# EAGLE design hbridge_v2 (EAGLE 6.4)
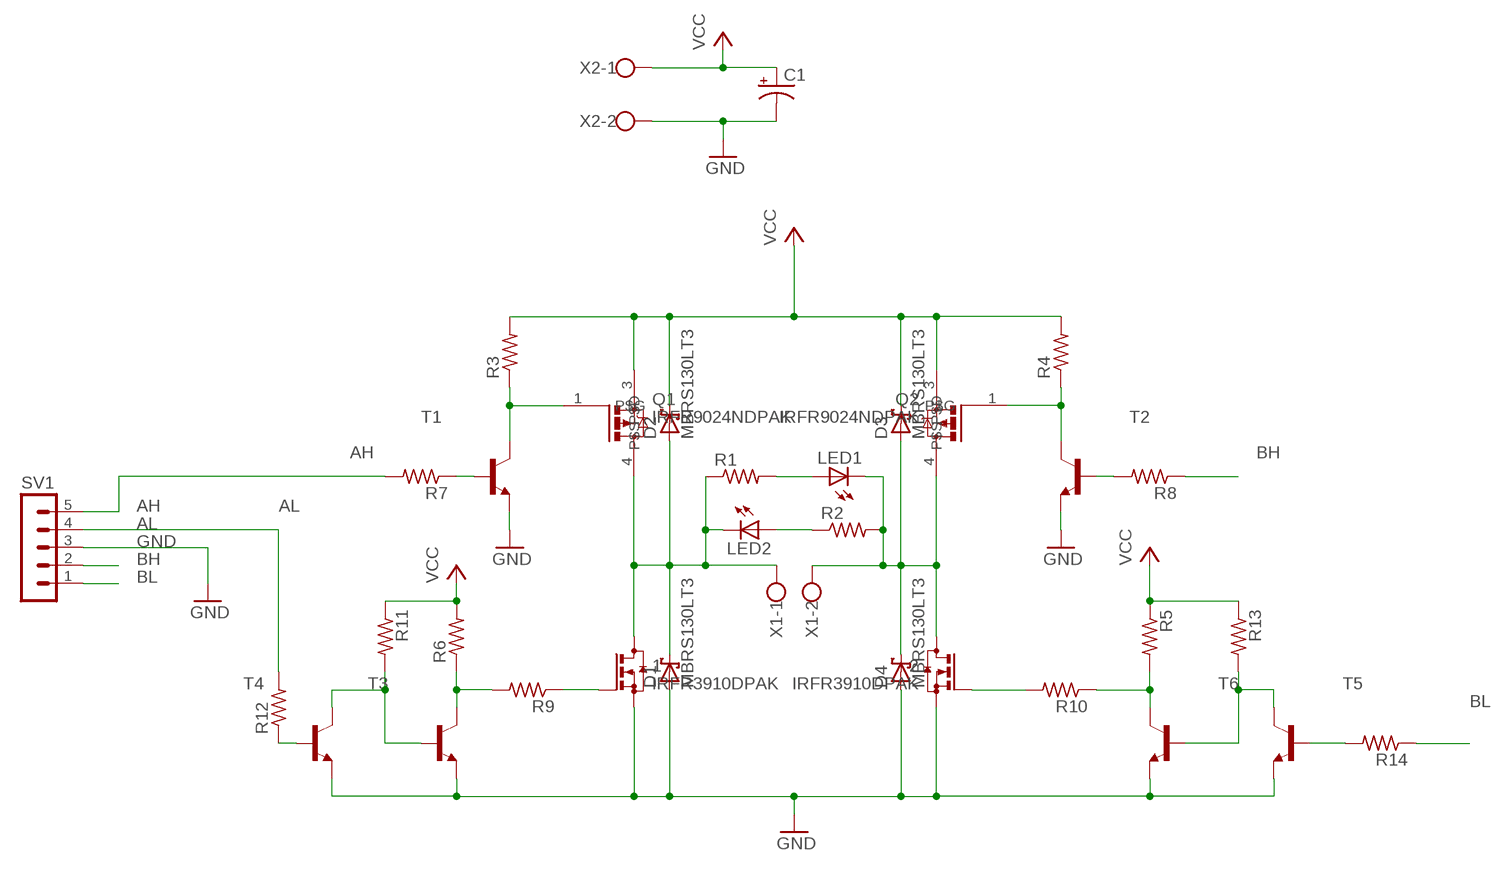
[diagram p0: schematic, sheet 1]

## Parts
1  IRFR3910DPAK  [D-PAK_TO252AA]
2  IRFR3910DPAK  [D-PAK_TO252AA]
C1  CPOL-USE5-10.5  [E5-10,5]
D1  MBRS130LT3  [SMB]
D2  MBRS130LT3  [SMB]
D3  MBRS130LT3  [SMB]
D4  MBRS130LT3  [SMB]
LED1  LEDCHIP-LED0805  [CHIP-LED0805]
LED2  LEDCHIP-LED0805  [CHIP-LED0805]
Q1  IRFR9024NDPAK  [D-PAK_TO252AA]
Q2  IRFR9024NDPAK  [D-PAK_TO252AA]
R1  R-US_R0805  [R0805]
R2  R-US_R0805  [R0805]
R3  R-US_R0805  [R0805]
R4  R-US_R0805  [R0805]
R5  R-US_R0805  [R0805]
R6  R-US_R0805  [R0805]
R7  R-US_R0805  [R0805]
R8  R-US_R0805  [R0805]
R9  R-US_R0805  [R0805]
R10  R-US_R0805  [R0805]
R11  R-US_R0805  [R0805]
R12  R-US_R0805  [R0805]
R13  R-US_R0805  [R0805]
R14  R-US_R0805  [R0805]
SV1  MA05-1  [MA05-1]
T1  MMBT2222ALT1-NPN-SOT23-BEC  [SOT23-BEC]
T2  MMBT2222ALT1-NPN-SOT23-BEC  [SOT23-BEC]
T3  MMBT2222ALT1-NPN-SOT23-BEC  [SOT23-BEC]
T4  MMBT2222ALT1-NPN-SOT23-BEC  [SOT23-BEC]
T5  MMBT2222ALT1-NPN-SOT23-BEC  [SOT23-BEC]
T6  MMBT2222ALT1-NPN-SOT23-BEC  [SOT23-BEC]
X1  W237-102  [W237-102]
X2  W237-102  [W237-102]

## Nets
AH: R7.2 SV1.5
AL: R12.2 SV1.4
BH: R8.1 SV1.2
BL: R14.1 SV1.1
GND: 1.3(S) 2.3(S) C1.- D1.A D4.A SV1.3 T1.E T2.E T3.E T4.E T5.E T6.E X2.2
M1: 1.4(D) D1.C D2.A LED2.C Q1.4(P$D) R1.1 X1.1
M2: 2.4(D) D3.A D4.C LED1.C Q2.4(P$D) R2.2 X1.2
N$1: LED2.A R2.1
N$2: LED1.A R1.2
N$3: 1.1(G) R9.1
N$4: R6.1 R9.2 T3.C
N$5: R11.2 T3.B T4.C
N$6: Q1.1(P$G) R3.1 T1.C
N$7: Q2.1(P$G) R4.1 T2.C
N$8: 2.1(G) R10.2
N$9: R7.1 T1.B
N$10: R12.1 T4.B
N$11: R8.2 T2.B
N$12: R5.2 R10.1 T6.C
N$14: R13.2 T5.C T6.B
N$17: R14.2 T5.B
VCC: C1.+ D2.C D3.C Q1.3(P$S) Q2.3(P$S) R3.2 R4.2 R5.1 R6.2 R11.1 R13.1 X2.1

## Library data of the parts
1 2 = RobThePyro:IRFR3910: http://www.irf.com/product-info/datasheets/data/irfr3910.pdf
C1 = resistor:CPOL-US: POLARIZED CAPACITOR, American symbol
D1-D4 = diode:MBRS130LT3: Schottky Power Rectifier Source: http://www.onsemi.com/pub/Collateral/MBRS130LT3-D.PDF
LED1 LED2 = led:LED: LED OSRAM: - CHIPLED LG R971, LG N971, LY N971, LG Q971, LY Q971, LO R971, LY R971 LH N974, LH R974 LS Q976, LO Q976, LY Q976 LO Q996 - Hyper CHIPLED LW Q18S LB Q993, LB Q99A, LB R99A - SideLED LS A670, LO A670, LY A670, LG A670, LP A670 LB A673, LV A673, LT A673, LW A673 LH A674 LY A675 LS A676, LA A676, LO A676, LY A676, LW A676 LS A679, LY A679, LG A679 - Hyper Micro SIDELED® LS Y876, LA Y876, LO Y876, LY Y876 LT Y87S - SmartLED LW L88C, LW L88S LB L89C, LB L89S, LG L890 LS L89K, LO L89K, LY L89K LS L896, LA L896, LO L896, LY L896 - TOPLED LS T670, LO T670, LY T670, LG T670, LP T670 LSG T670, LSP T670, LSY T670, LOP T670, LYG T670 LG T671, LOG T671, LSG T671 LB T673, LV T673, LT T673, LW T673 LH T674 LS T676, LA T676, LO T676, LY T676, LB T676, LH T676, LSB T676, LW T676 LB T67C, LV T67C, LT T67C, LS T67K, LO T67K, LY T67K, LW E67C LS E67B, LA E67B, LO E67B, LY E67B, LB E67C, LV E67C, LT E67C LW T67C LS T679, LY T679, LG T679 LS T770, LO T770, LY T770, LG T770, LP T770 LB T773, LV T773, LT T773, LW T773 LH T774 LS E675, LA E675, LY E675, LS T675 LS T776, LA T776, LO T776, LY T776, LB T776 LHGB T686 LT T68C, LB T68C - Hyper Mini TOPLED® LB M676 - Mini TOPLED Santana® LG M470 LS M47K, LO M47K, LY M47K Source: http://www.osram.convergy.de LUXEON: - LUMILED® LXK2-PW12-R00, LXK2-PW12-S00, LXK2-PW14-U00, LXK2-PW14-V00 LXK2-PM12-R00, LXK2-PM12-S00, LXK2-PM14-U00 LXK2-PE12-Q00, LXK2-PE12-R00, LXK2-PE12-S00, LXK2-PE14-T00, LXK2-PE14-U00 LXK2-PB12-K00, LXK2-PB12-L00, LXK2-PB12-M00, LXK2-PB14-N00, LXK2-PB14-P00, LXK2-PB14-Q00 LXK2-PR12-L00, LXK2-PR12-M00, LXK2-PR14-Q00, LXK2-PR14-R00 LXK2-PD12-Q00, LXK2-PD12-R00, LXK2-PD12-S00 LXK2-PH12-R00, LXK2-PH12-S00 LXK2-PL12-P00, LXK2-PL12-Q00, LXK2-PL12-R00 Source: www.luxeon.com KINGBRIGHT: KA-3528ASYC Source: www.kingbright.com
Q1 Q2 = RobThePyro:IRFR9024N: http://www.irf.com/product-info/datasheets/data/irfr9024n.pdf
R1-R14 = resistor:R-US_: RESISTOR, American symbol
SV1 = con-lstb:MA05-1: PIN HEADER; OC_FARNELL: unknown; OC_NEWARK: unknown
T1-T6 = transistor:*-NPN-: NPN Transistror BF959 corrected 2008.03.06
X1 X2 = con-wago-500:W237-102: WAGO SCREW CLAMP; MPN: 237-102; OC_FARNELL: unknown; OC_NEWARK: 70K9898

## Board
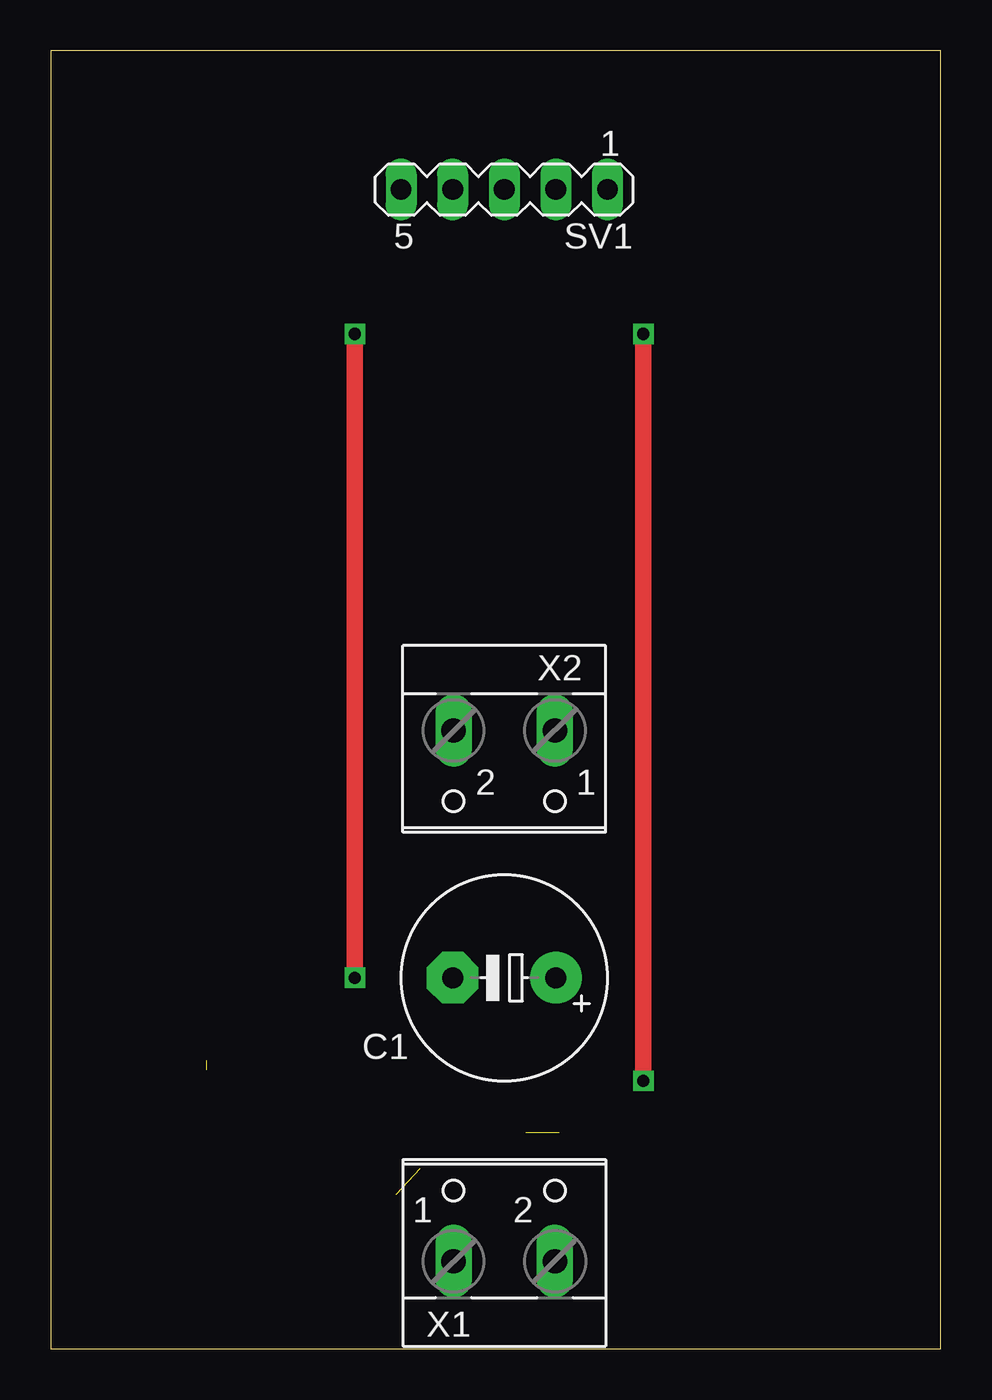
[diagram p1: board, top side]
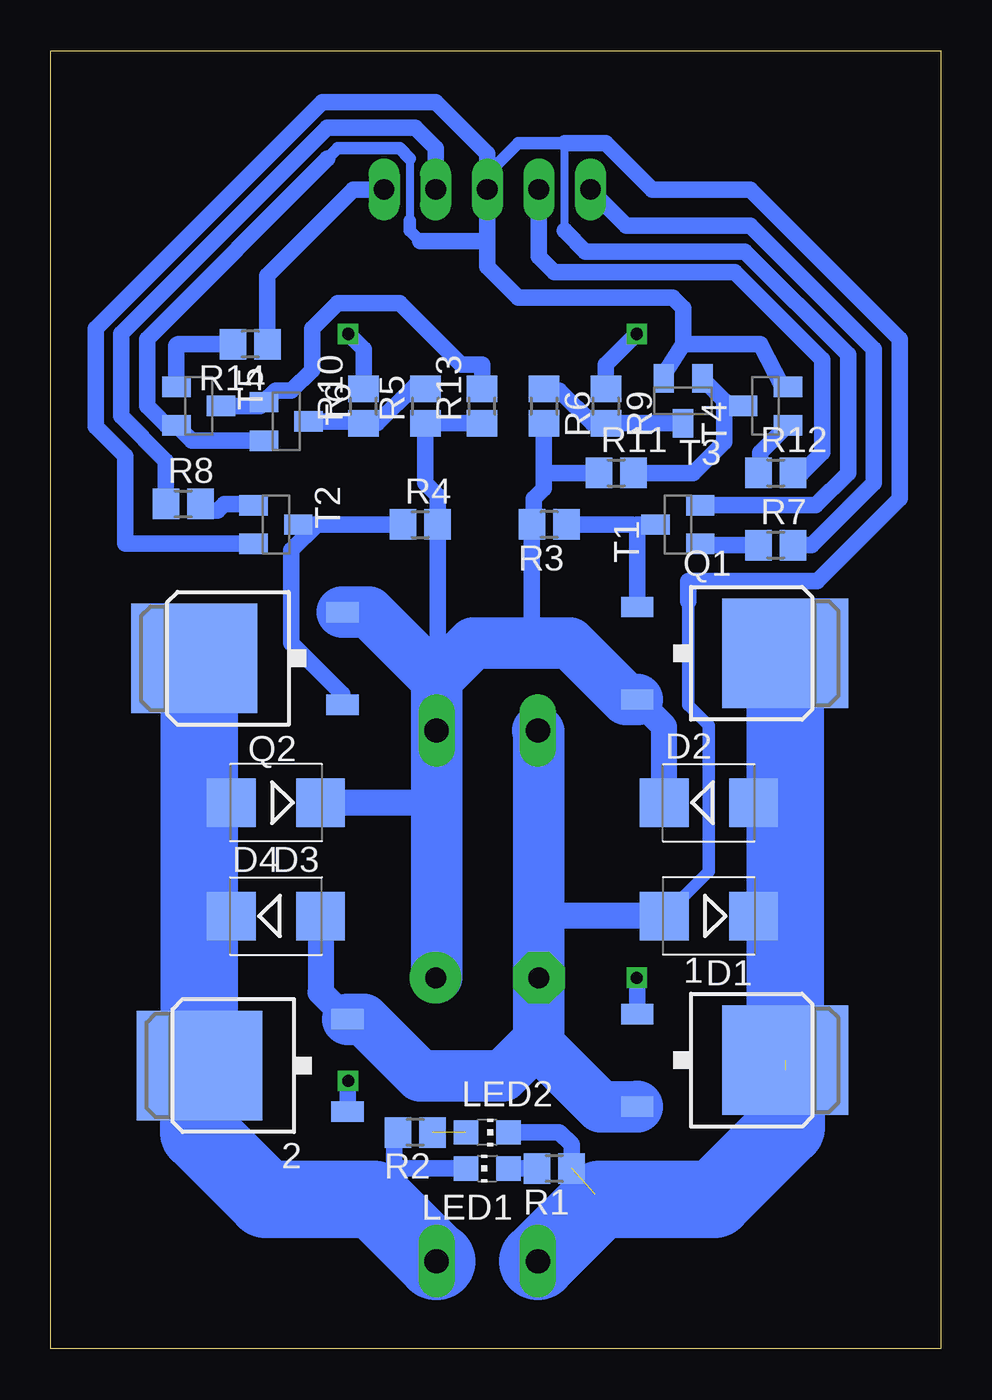
[diagram p2: board, bottom side, seen from below]

Size 43.87 x 64 mm. Coordinates in mm from the lower left corner, seen from the top.
Outline: 0,0 43.87,0 43.87,64 0,64 0,0
Copper layers (1*16): Top 0.035mm / dielectric 1.5mm / Bottom 0.035mm
Design rules "default": minimum track width 10mil, minimum drill 24mil, track to track 8mil, track to pad 8mil, pad to pad 8mil, via to via 8mil, smd to smd 8mil, copper to edge 40mil, drill to drill 8mil, minimum pad ring 10mil, minimum via ring 8mil, stop-mask expansion 4mil, vias tented up to drill 0mil, thermal gap 10mil

### Footprints (pad centres in the part's own frame; a part is rotated, then mirrored left to right if it is on the bottom)
D-PAK_TO252AA = smd 1 x 1.6: 1 -2.28,-4.8; 3 2.28,-4.8 | smd 5.4 x 6.2: 4 0,2.5
E5-10,5 = drill 1.016 pad 2.54: + -2.54,0 | drill 1.016 pad 2.54 octagon: - 2.54,0
SMB = smd 2.4 x 2.4: A 2.2,0; C -2.2,0
CHIP-LED0805 = smd 1.2 x 1.2: A 0,-1.05; C 0,1.05
R0805 = smd 1.3 x 1.5: 1 -0.85,0; 2 0.85,0
MA05-1 = drill 1.016 long: 1 -5.08,0; 2 -2.54,0; 3 0,0; 4 2.54,0; 5 5.08,0
SOT23-BEC = smd 1 x 1.4: B -0.95,-1.1; C 0,1.1; E 0.95,-1.1
W237-102 = drill 1.194 long: 1 -2.5,-1.27; 2 2.5,-1.27

### Placement (x,y rotation side)
1  10.16,14.22 270 bottom
2  34.04,13.97 90 bottom
C1  22.35,18.29 180 top
D1  11.43,21.34 180 bottom
D2  11.43,26.92 0 bottom
D3  32.77,26.92 180 bottom
D4  32.77,21.34 0 bottom
LED1  22.35,8.89 90 bottom
LED2  22.35,10.67 270 bottom
Q1  10.16,34.29 270 bottom
Q2  34.29,34.04 90 bottom
R1  19.05,8.89 180 bottom
R2  25.91,10.67 180 bottom
R3  19.3,40.64 180 bottom
R4  25.65,40.64 0 bottom
R5  25.4,46.48 90 bottom
R6  19.56,46.48 270 bottom
R7  8.13,39.62 0 bottom
R8  37.34,41.66 0 bottom
R9  16.51,46.48 270 bottom
R10  28.45,46.48 90 bottom
R11  16,43.18 0 bottom
R12  8.13,43.18 0 bottom
R13  22.61,46.48 90 bottom
R14  34.04,49.53 180 bottom
SV1  22.35,57.15 180 top
T1  12.95,40.64 90 bottom
T2  32.77,40.64 270 bottom
T3  12.7,46.74 180 bottom
T4  8.64,46.48 90 bottom
T5  36.58,46.48 270 bottom
T6  32.26,45.72 270 bottom
X1  22.35,5.59 0 top
X2  22.35,29.21 180 top

### Tracks (layer width: path | path; a pad name or v marks a point on that pad's centre or on a via)
AH
  Bottom 0.813: R7.2 6.35,39.62 3.3,42.67 3.3,49.28 9.4,55.37 15.49,55.37 SV1.5
AL
  Bottom 0.813: SV1.4 19.81,53.85 19.05,53.09 10.16,53.09 5.84,48.77 5.84,44.2 6.86,43.18 R12.2
BH
  Bottom 0.813: SV1.2 24.89,59.18 25.91,60.2 30.23,60.2 40.39,50.04 40.39,45.97 38.19,43.78 R8.1
BL
  Bottom 0.813: SV1.1 28.96,57.15 33.19,52.92 R14.1
GND
  Bottom 0.406: 18.54,55.12 18.54,59.44 | 26.16,58.67 26.16,55.63
  Bottom 0.61: 12.45,36.83 12.45,31.75 11.43,30.73 11.43,23.54 D1.A | 18.54,59.44 20.83,59.44 22.35,57.91 SV1.3 | 26.16,58.67 26.67,59.18 29.72,59.18 30.23,58.67 | 26.16,55.63 26.16,55.12 25.65,54.61
  Bottom 0.813: 22.35,54.61 SV1.3 22.35,58.93 24.89,61.47 30.48,61.47 41.66,50.29 41.66,45.47 40.2,44.01 40.2,39.69 T2.E 39.18,39.69 | 22.35,54.61 22.35,53.34 20.83,51.82 13.21,51.82 12.7,51.31 12.7,49.53 | 12.7,49.53 13.72,47.9 T3.E | T4.E 7.81,47.43 8.89,49.53 12.7,49.53 | 18.54,59.44 16.51,59.44 14.22,57.15 9.4,57.15 2.03,49.78 2.03,41.91 6.1,37.85 12.45,37.85 12.45,36.83 | 25.65,54.61 22.35,54.61 | T1.E 6.16,41.59 4.57,43.18 4.57,49.02 9.65,54.1 17.53,54.1 18.54,55.12 | T6.E 36.91,44.77 T5.E 38.17,45.53 39.12,46.48 39.12,49.78 30.23,58.67
  Bottom 1.27: D1.A 19.56,21.34 19.81,21.59 | D4.A 30.57,17.58 2.3
  Bottom 2.54: X2.2 19.81,30.44 19.81,21.59 C1.- 19.81,15.24 | 19.81,15.24 19.81,14.99 16.76,11.94 1.3 | 2.3 28.44,16.25 25.65,13.46 21.59,13.46 19.81,15.24
M1  (2 unrouted)
  Bottom 0.813: D2.A 7.66,26.92 | D1.C 7.91,21.34 7.66,21.59 | R1.1 18.2,10.07 18.8,10.67 LED2.C | 16.76,7.37 16.76,7.11 15.75,7.11 15.24,7.62 17.02,7.62 20.32,4.32 19.05,4.32 16.51,6.86
  Bottom 3.81: Q1.4 7.66,26.92 7.66,21.59 7.66,13.76 7.62,13.72 7.62,10.92 11.18,7.37 16.76,7.37 16.8,7.37 X1.1
M2
  Bottom 0.813: D3.A 36.28,26.92 36.54,26.67 | D4.C 36.54,21.34 | LED1.C 26.92,8.89 | 26.92,8.89 26.92,10.5 R2.2 | 26.92,8.89 26.92,8.38 27.94,7.37
  Bottom 3.81: X1.2 24.89,4.32 27.94,7.37 33.27,7.37 36.58,10.67 36.58,13.93 2.4 36.54,21.34 36.54,26.67 36.54,33.78 Q2.4
N$1  (1 unrouted)
N$2
  Bottom 0.813: LED1.A R1.2
N$3  (via drill 0.6)
  Top 0.813: v14.99,18.29 v14.99,50.04
  Bottom 0.813: 1.1 14.96,18.26 v14.99,18.29 | R9.1 16.51,48.51 v14.99,50.04
N$4
  Bottom 0.813: T3.C R9.2 17.18,45.63 18.8,47.24 19.47,47.24 R6.1
N$5
  Bottom 0.813: R11.2 12.19,43.18 10.67,44.7 10.67,46.48 | 10.67,46.48 T4.C | 10.67,46.48 10.67,46.75 T3.B
N$6
  Bottom 0.813: Q1.1 14.96,40.39 | 14.96,40.39 14.96,40.61 14.99,40.64 T1.C | R3.1 15.21,40.64 14.96,40.39
N$7
  Bottom 0.813: T2.C 30.73,40.64 | 30.73,40.64 R4.1 | Q2.1 29.49,32.28 32,34.8 32,39.37 30.73,40.64
N$8  (via drill 0.6)
  Top 0.813: v29.21,13.21 v29.21,50.04
  Bottom 0.813: 2.1 29.24,13.18 v29.21,13.21 | R10.2 28.45,49.28 v29.21,50.04
N$9
  Bottom 0.813: R7.1 11.79,39.62 T1.B
N$10
  Bottom 0.813: T4.B 7.55,45.53 8.89,44.2 8.89,43.27 R12.1
N$11
  Bottom 0.813: R8.2 36.3,41.34 35.63,41.34 35.31,41.66 33.93,41.66 T2.B
N$12
  Bottom 0.813: R10.1 | R10.1 27.77,45.63 25.91,47.5 25.31,47.5 R5.2 | T6.C 28.54,45.72 R10.1
N$14
  Bottom 0.813: T5.C 33.55,46.48 T6.B 32.78,47.24 32,47.24 30.99,48.26 30.99,50.29 29.72,51.56 26.67,51.56 23.62,48.51 22.61,48.51 R13.2
N$17
  Bottom 0.813: R14.2 37.59,49.53 37.68,49.45 T5.B
VCC
  Bottom 0.813: 27.85,36.66 28.19,36.32 | R6.2 19.56,42.93 | 19.56,42.93 19.56,42.42 20.07,41.91 20.07,40.73 R3.2 20.15,34.89 20.07,34.8 | R11.1 19.3,43.18 19.56,42.93 | 18.63,34.96 18.8,34.8 | 24.47,33.36 24.8,33.69 R4.2 24.8,42.08 25.4,42.67 R5.1 R13.1
  Bottom 1.27: D2.C 13.63,30.68 Q1.3 | D3.C 24.85,26.92
  Bottom 2.54: C1.+ 24.85,18.33 24.85,26.92 X2.1 24.85,32.98 | 24.85,32.98 28.19,36.32 Q2.3 | Q1.3 15.5,32.01 18.29,34.8 18.8,34.8 20.07,34.8 23.03,34.8 24.47,33.36 24.85,32.98